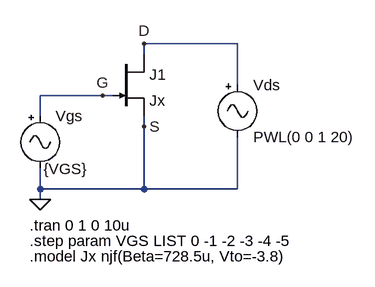
[diagram p0: schematic CircuitoTerceraParte.asc]
CircuitoTerceraParte.asc, the LTspice schematic file:
Version 4
SHEET 1 880 680
WIRE 384 96 240 96
WIRE 240 112 240 96
WIRE 384 160 384 96
WIRE 176 176 80 176
WIRE 192 176 176 176
WIRE 80 208 80 176
WIRE 240 224 240 208
WIRE 80 320 80 288
WIRE 240 320 240 224
WIRE 240 320 80 320
WIRE 384 320 384 240
WIRE 384 320 240 320
WIRE 80 336 80 320
FLAG 80 336 0
FLAG 176 176 G
FLAG 240 96 D
FLAG 240 224 S
SYMBOL njf 192 112 R0
SYMATTR InstName J1
SYMATTR Value Jx
SYMBOL Misc\\signal 80 192 R0
WINDOW 3 5 97 Left 2
WINDOW 123 0 0 Left 0
WINDOW 39 0 0 Left 0
SYMATTR Value {VGS}
SYMATTR InstName Vgs
SYMBOL Misc\\signal 384 144 R0
WINDOW 123 0 0 Left 0
WINDOW 39 0 0 Left 0
SYMATTR InstName Vds
SYMATTR Value PWL(0 0 1 20)
TEXT 64 376 Left 2 !.tran 0 1 0 10u
TEXT 64 400 Left 2 !.step param VGS LIST 0 -1 -2 -3 -4 -5
TEXT 64 424 Left 2 !.model Jx njf(Beta=728.5u, Vto=-3.8)

The netlist it stands for:
* CircuitoTerceraParte.asc
J1 D G 0 Jx
Vgs G 0 {VGS}
Vds D 0 PWL(0 0 1 20)
.model NJF NJF
.model PJF PJF
.lib standard.jft
.tran 0 1 0 10u
.step param VGS LIST 0 -1 -2 -3 -4 -5
.model Jx njf(Beta=728.5u, Vto=-3.8)
.backanno
.end